# Altium schematic sheet SPI_SD.SchDoc
size A4; SheetNumber: 14; SheetTotal: 16
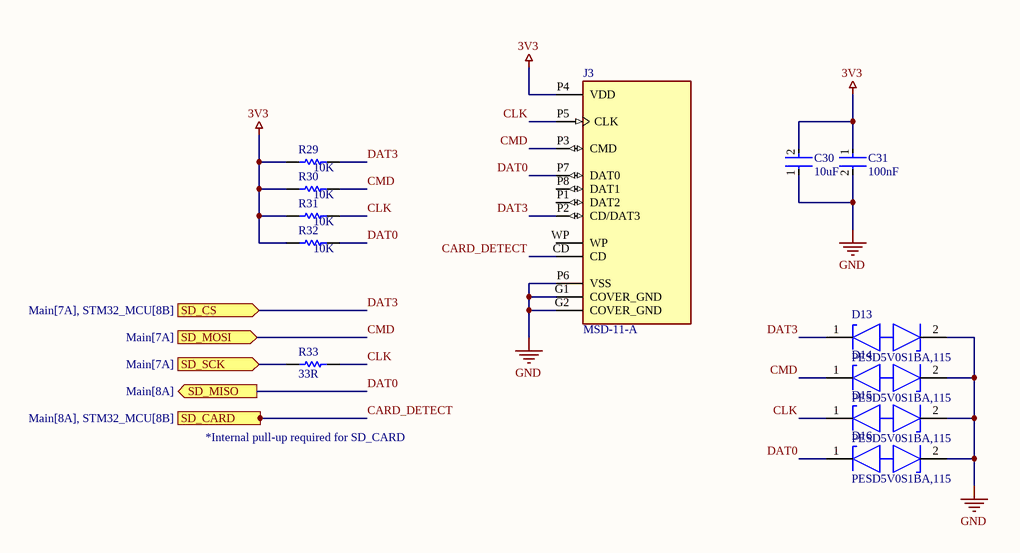
[diagram p0: SPI_SD.SchDoc]

## Parts
C30  10uF  [FP-C1608-080-0_1-MFG]
C31  100nF  [FP-CGA3E-0_3-0_1-IPC_A]
D13  PESD5V0S1BA,115  [FP-SOD323-CA-MFG]
D14  PESD5V0S1BA,115  [FP-SOD323-CA-MFG]
D15  PESD5V0S1BA,115  [FP-SOD323-CA-MFG]
D16  PESD5V0S1BA,115  [FP-SOD323-CA-MFG]
J3  MSD-11-A  [CUI_MSD-11-A]
R29  10K  [RESC1609X55X30LL15T15]
R30  10K  [RESC1609X55X30LL15T15]
R31  10K  [RESC1609X55X30LL15T15]
R32  10K  [RESC1609X55X30LL15T15]
R33  33R  [RESC1608X55X25LL10T15]

## Ports
SD_CARD (out, see Main[8A], STM32_MCU[8B]), SD_CS (in, see Main[7A], STM32_MCU[8B]), SD_MISO (out, see Main[8A]), SD_MOSI (in, see Main[7A]), SD_SCK (in, see Main[7A])

## Nets
3V3: C30.2 C31.1 J3.P4(VDD) R29.1 R30.1 R31.1 R32.1
GND: C30.1 C31.2 D13.2(K2) D14.2(K2) D15.2(K2) D16.2(K2) J3.G1(COVER_GND) J3.G2(COVER_GND) J3.P6(VSS)
CARD_DETECT: J3.CD ; port SD_CARD
CLK: D15.1(K1) J3.P5(CLK) R31.2 R33.2
CMD: D14.1(K1) J3.P3(CMD) R30.2 ; port SD_MOSI
DAT0: D16.1(K1) J3.P7(DAT0) R32.2 ; port SD_MISO
DAT3: D13.1(K1) J3.P2(CD/DAT3) R29.2 ; port SD_CS
SD_SCK: R33.1 ; port SD_SCK

Not connected (* = marked no-connect by the designer): J3 P1(DAT2) P8(DAT1) WP

## Notes on the sheet
- *Internal pull-up required for SD_CARD

## Library data of the parts
C30 = CMP-2000-04979-3: Multilayer Ceramic Capacitors 10μF ±10% 10V X5R SMD 0603; Dielectric Material: Ceramic; Construction: Flat; Height: 0.8mm; Thickness: 0.035inch; Case Code (Metric): 1608; Radiation Hardening: No; Number of Pins: 2; Voltage Rating (DC): 10V; Depth: 0.8mm; Voltage: 10V; RoHS Compliant: Yes; Voltage Rating: 10V; Package Quantity: 1; Resistor Type: Ceramic; Termination: SMD/SMT; Lead Free: Lead Free; REACH SVHC: No SVHC; Tolerance: 10%; Mount: Surface Mount; Series: C; Packaging: Tape and Reel; Width: 0.8mm; Dielectric: X5R; Weight: 7.1E-05oz; Length: 1.6mm; Max Operating Temperature: 85°C; Case Code (Imperial): 0603; Case/Package: 0603; Min Operating Temperature: -55°C; Capacitance: 10uF
C31 = CMP-2000-07546-2: Cap Ceramic 100nF 50V X7R 10% Pad SMD 0603 +125°C Automotive T/R; Weight: 7.1E-05oz; Composition: Ceramic; Max Operating Temperature: 125°C; Termination: SMD/SMT; Dielectric: X7R; Length: 1.6mm; Package Quantity: 1; REACH SVHC: No SVHC; Lead Free: Lead Free; Case Code (Metric): 1608; Min Operating Temperature: -55°C; Packaging: Tape and Reel; Tolerance: 10%; Voltage Rating: 50V; Case Code (Imperial): 0603; Capacitance: 100nF; Case/Package: 0603; Voltage Rating (DC): 50V; Depth: 0.8mm; Radiation Hardening: No; Ratings: AEC-Q200; Mount: Surface Mount; Voltage: 50V; Thickness: 0.035inch; Width: 0.8mm; Height: 0.8mm
D13-D16 = CMP-14432-000001-1: TVS DIODE 5V 14V SOD323
J3 = MSD-11-A: Micro SD Card Connector, 8 Positions, Connector and Ejector, Push In, Auto Eject Out, Surface Mount, 1.85 mm Heaight Above Board, Gold Flash; MF: Same Sky; SnapEDA_Link: https://www.snapeda.com/parts/MSD-11-A/Same+Sky/view-part/?ref=snap; Package: None; Value: *; MP: MSD-11-A; Check_prices: https://www.snapeda.com/parts/MSD-11-A/Same+Sky/view-part/?ref=eda
R29-R32 = CMP-1012-00623-3: Chip Resistor, 10 KOhm, +/- 1%, 0.1 W, -55 to 155 degC, 0603 (1608 Metric), RoHS, Tape and Reel; Manufacturer: Panasonic; Voltage Rating: 75V; Case\/Package: 0603; Power Rating: 100mW; Resistance: 10KOhm; Temperature Coefficient: 100ppm\/degreesC; Number of Pins: 2; Package Reference: 603; Depth: 0.8mm; Mount: SurfaceMount; Package Description: 2-Pin Surface Mount Device, Body 1.6 x 0.85 mm; Datasheet Version: 02/2017; Length: 1.6mm; Lead Free: LeadFree; Height: 0.45mm; Number of Terminations: 2; Max Power Dissipation: 100mW; Min Operating Temperature: -55degC; Datasheet URL: https://industrial.panasonic.com/cdbs/www-data/pdf/RDA0000/AOA0000C304.pdf; Termination: SMD/SMT; Case Code (Metric): 1608; Case Code (Imperial): 0603; Tolerance: 1%; Max Operating Temperature: 155degC; RoHSCompliant: true; Voltage Rating (DC): 75V; Radiation Hardening: No; Packaging: TapeandReel; Composition: ThickFilm; Mounting Technology: SurfaceMount; Manufacturer URL: http://www.panasonic.com/; Width: 0.031inch; REACH SVHC: NoSVHC; Contact Plating: Tin; Military Standard: Not; Package Quantity: 1
R33 = CMP-2000-06939-1: Chip Resistor, 33 Ohm, +/- 1%, 0.1 W, -55 to 155 degC, 0603 (1608 Metric), RoHS, Tape and Reel; Temperature Coefficient: 100PPM/C; Voltage Rating: 75V; Unit Weight: 0.000071oz; Power Rating: 100mW; Brand: Yageo; Resistance: 33Ohms; Product Category: ThickFilmResistors; Packaging: Reel; Tolerance: 1%; RoHS: True; Height: 0.45mm; Case Code - mm: 1608; Series: RC; Datasheet URL: http://www.yageo.com/documents/recent/PYu-RC_Group_51_RoHS_L_7.pdf; Operating Temperature Range: -55Cto+155C; Type: GeneralPurposeChipResistorSurfaceMount; Product: ThickFilmResistorsGeneralPurpose; Package / Case: 0603(1608metric); Width: 0.8mm; Length: 1.6mm; Case Code - in: 0603; Mounting Technology: SurfaceMount; Manufacturer URL: http://www.yageo.com/; Manufacturer: Yageo; Package Reference: 0603; Termination Style: SMD/SMT; Datasheet Version: Rev. 7, 05/2017; Package Description: 2-Pin Surface Mount Device, Body 1.6 x 0.8 mm